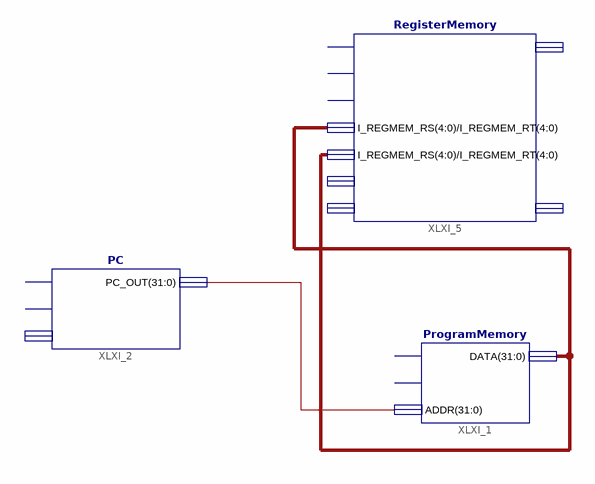
[diagram p0: schematic sheet 1]
// Xilinx ISE schematic sch.sch (artix7) as structural Verilog: 3 symbols, 0 ports
module sch (
);

  wire W_PC;
  wire [4:0] XLXN_6;

  ProgramMemory XLXI_1 (.ADDR({32{W_PC}}), .DATA(XLXN_6));  // open: CLK, RESET
  PC XLXI_2 (.PC_OUT({32{W_PC}}));  // open: CLK, RESET, PC_IN
  RegisterMemory XLXI_5 (
    .I_REGMEM_RS(XLXN_6), .I_REGMEM_RT(XLXN_6));  // open: CLK, RESET, I_REGMEM_REGWR, I_REGMEM_RD, I_REGMEM_WRITE_DATA, A, B
endmodule
